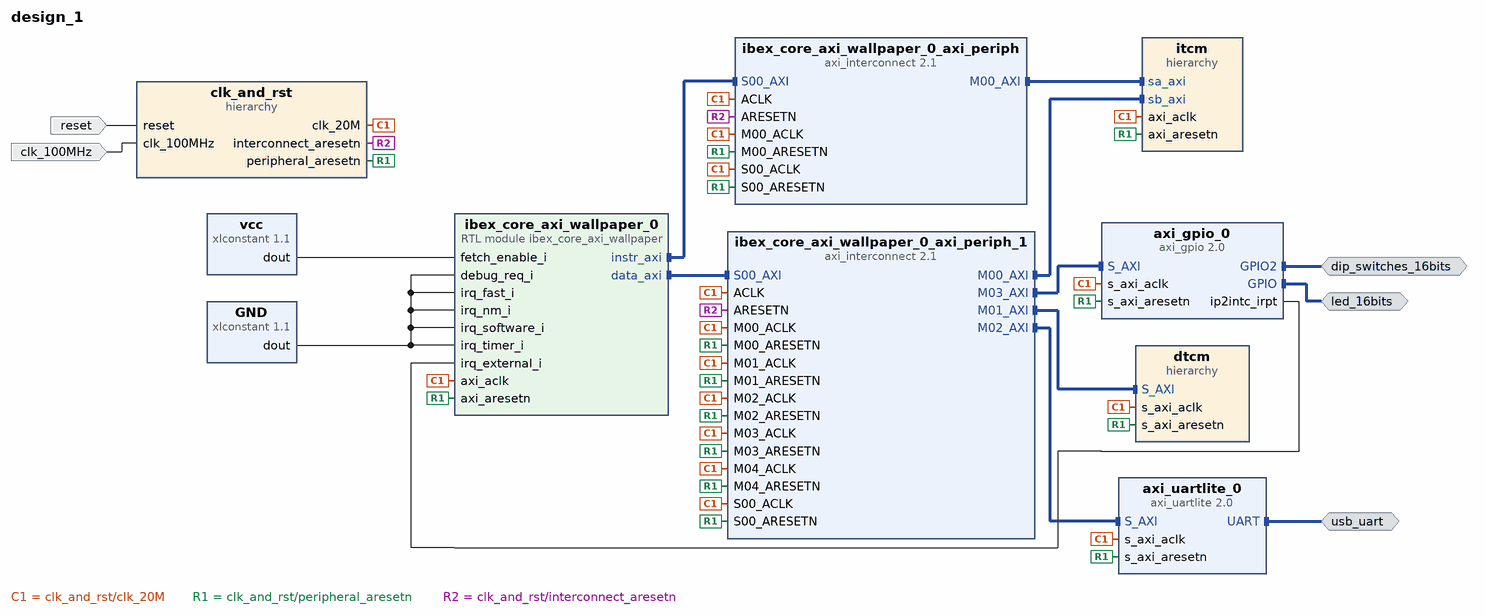
[diagram p0: block diagram of the top level]
# Vivado block design design_1, xc7a100tcsg324-1, Vivado 2017.4
create_bd_design design_1

create_bd_intf_port -mode Master -vlnv xilinx.com:interface:uart_rtl:1.0 usb_uart
create_bd_intf_port -mode Master -vlnv xilinx.com:interface:gpio_rtl:1.0 led_16bits
create_bd_intf_port -mode Master -vlnv xilinx.com:interface:gpio_rtl:1.0 dip_switches_16bits
create_bd_port -dir I -type rst reset
set_property -dict {CONFIG.POLARITY ACTIVE_LOW} [get_bd_ports reset]
create_bd_port -dir I -type clk clk_100MHz
set_property -dict {CONFIG.FREQ_HZ 100000000} [get_bd_ports clk_100MHz]

create_bd_cell -type ip -vlnv xilinx.com:ip:xlconstant:1.1 vcc
create_bd_cell -type ip -vlnv xilinx.com:ip:xlconstant:1.1 GND
set_property -dict {CONFIG.CONST_WIDTH 15 CONFIG.CONST_VAL 0} [get_bd_cells GND]
create_bd_cell -type ip -vlnv xilinx.com:ip:axi_uartlite:2.0 axi_uartlite_0
set_property -dict [list \
  CONFIG.C_BAUDRATE 115200 \
  CONFIG.USE_BOARD_FLOW true \
  CONFIG.UARTLITE_BOARD_INTERFACE usb_uart \
] [get_bd_cells axi_uartlite_0]
create_bd_cell -type ip -vlnv xilinx.com:ip:axi_gpio:2.0 axi_gpio_0
set_property -dict [list \
  CONFIG.C_INTERRUPT_PRESENT 1 \
  CONFIG.USE_BOARD_FLOW true \
  CONFIG.GPIO_BOARD_INTERFACE led_16bits \
  CONFIG.GPIO2_BOARD_INTERFACE dip_switches_16bits \
] [get_bd_cells axi_gpio_0]
create_bd_cell -type hier itcm
create_bd_cell -type hier dtcm
create_bd_cell -type module -reference ibex_core_axi_wallpaper ibex_core_axi_wallpaper_0
create_bd_cell -type ip -vlnv xilinx.com:ip:axi_interconnect:2.1 ibex_core_axi_wallpaper_0_axi_periph
set_property -dict {CONFIG.NUM_MI 1} [get_bd_cells ibex_core_axi_wallpaper_0_axi_periph]
create_bd_cell -type ip -vlnv xilinx.com:ip:axi_interconnect:2.1 ibex_core_axi_wallpaper_0_axi_periph_1
set_property -dict {CONFIG.NUM_MI 5} [get_bd_cells ibex_core_axi_wallpaper_0_axi_periph_1]
create_bd_cell -type hier clk_and_rst

# ---- hierarchy /itcm ----
current_bd_instance /itcm
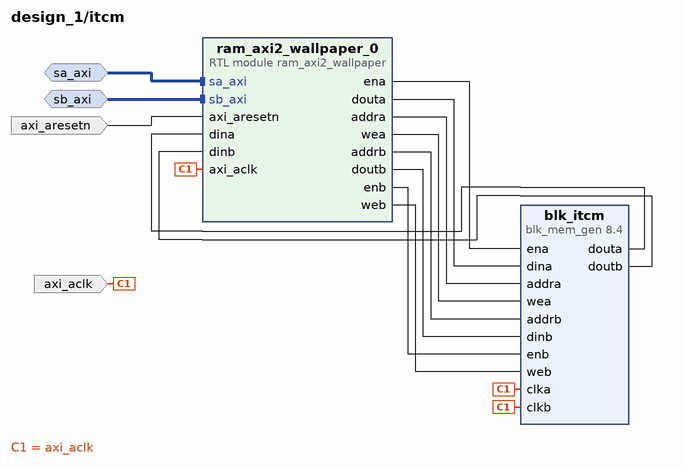
[diagram p1: block diagram inside /itcm]
create_bd_intf_pin -mode Slave -vlnv xilinx.com:interface:aximm_rtl:1.0 sa_axi
create_bd_intf_pin -mode Slave -vlnv xilinx.com:interface:aximm_rtl:1.0 sb_axi
create_bd_pin -dir I -type clk axi_aclk
create_bd_pin -dir I -type rst axi_aresetn

create_bd_cell -type module -reference ram_axi2_wallpaper ram_axi2_wallpaper_0
create_bd_cell -type ip -vlnv xilinx.com:ip:blk_mem_gen:8.4 blk_itcm
set_property -dict [list \
  CONFIG.Memory_Type True_Dual_Port_RAM \
  CONFIG.Enable_32bit_Address true \
  CONFIG.Assume_Synchronous_Clk true \
  CONFIG.Write_Depth_A 16384 \
  CONFIG.Enable_B Use_ENB_Pin \
  CONFIG.Register_PortA_Output_of_Memory_Primitives false \
  CONFIG.Register_PortB_Output_of_Memory_Primitives false \
  CONFIG.Load_Init_File true \
  CONFIG.Coe_File ../../../../../../../rtl/instr_rom_init/instr_rom_init.coe \
  CONFIG.Fill_Remaining_Memory_Locations true \
  CONFIG.Use_RSTA_Pin false \
  CONFIG.Use_RSTB_Pin false \
  CONFIG.Port_B_Clock 100 \
  CONFIG.Port_B_Write_Rate 50 \
  CONFIG.Port_B_Enable_Rate 100 \
  CONFIG.use_bram_block Stand_Alone \
] [get_bd_cells blk_itcm]

# ---- hierarchy /dtcm ----
current_bd_instance /dtcm
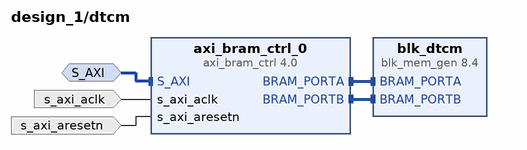
[diagram p2: block diagram inside /dtcm]
create_bd_intf_pin -mode Slave -vlnv xilinx.com:interface:aximm_rtl:1.0 S_AXI
create_bd_pin -dir I -type clk s_axi_aclk
create_bd_pin -dir I -type rst s_axi_aresetn

create_bd_cell -type ip -vlnv xilinx.com:ip:axi_bram_ctrl:4.0 axi_bram_ctrl_0
set_property -dict {CONFIG.SINGLE_PORT_BRAM 0} [get_bd_cells axi_bram_ctrl_0]
create_bd_cell -type ip -vlnv xilinx.com:ip:blk_mem_gen:8.4 blk_dtcm
set_property -dict {CONFIG.Memory_Type True_Dual_Port_RAM} [get_bd_cells blk_dtcm]

# ---- hierarchy /clk_and_rst ----
current_bd_instance /clk_and_rst
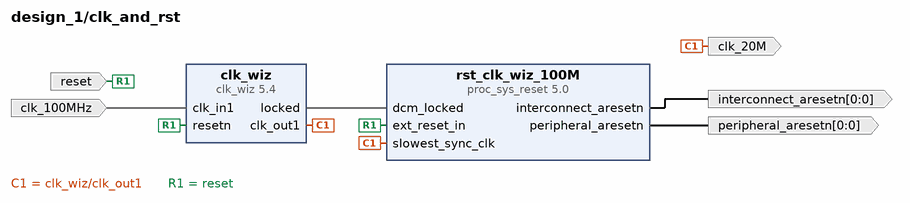
[diagram p3: block diagram inside /clk_and_rst]
create_bd_pin -dir O -type clk clk_20M
create_bd_pin -dir I -type rst reset
create_bd_pin -dir I -type clk clk_100MHz
create_bd_pin -dir O -from 0 -to 0 -type rst interconnect_aresetn
create_bd_pin -dir O -from 0 -to 0 -type rst peripheral_aresetn

create_bd_cell -type ip -vlnv xilinx.com:ip:clk_wiz:5.4 clk_wiz
set_property -dict [list \
  CONFIG.CLKOUT1_REQUESTED_OUT_FREQ 20.000 \
  CONFIG.RESET_PORT resetn \
  CONFIG.MMCM_DIVCLK_DIVIDE 1 \
  CONFIG.MMCM_CLKFBOUT_MULT_F 8.500 \
  CONFIG.MMCM_CLKOUT0_DIVIDE_F 42.500 \
  CONFIG.RESET_TYPE ACTIVE_LOW \
  CONFIG.USE_BOARD_FLOW true \
  CONFIG.CLK_IN1_BOARD_INTERFACE sys_clock \
  CONFIG.RESET_BOARD_INTERFACE reset \
  CONFIG.CLKOUT1_JITTER 193.154 \
  CONFIG.CLKOUT1_PHASE_ERROR 109.126 \
] [get_bd_cells clk_wiz]
create_bd_cell -type ip -vlnv xilinx.com:ip:proc_sys_reset:5.0 rst_clk_wiz_100M
set_property -dict {CONFIG.USE_BOARD_FLOW true CONFIG.RESET_BOARD_INTERFACE reset} [get_bd_cells rst_clk_wiz_100M]

# ---- connections ----

current_bd_instance /itcm
connect_bd_intf_net [get_bd_intf_pins sa_axi] [get_bd_intf_pins ram_axi2_wallpaper_0/sa_axi]
connect_bd_intf_net [get_bd_intf_pins sb_axi] [get_bd_intf_pins ram_axi2_wallpaper_0/sb_axi]
connect_bd_net [get_bd_pins ram_axi2_wallpaper_0/ena] [get_bd_pins blk_itcm/ena]
connect_bd_net [get_bd_pins ram_axi2_wallpaper_0/douta] [get_bd_pins blk_itcm/dina]
connect_bd_net [get_bd_pins ram_axi2_wallpaper_0/addra] [get_bd_pins blk_itcm/addra]
connect_bd_net [get_bd_pins blk_itcm/douta] [get_bd_pins ram_axi2_wallpaper_0/dina]
connect_bd_net [get_bd_pins ram_axi2_wallpaper_0/wea] [get_bd_pins blk_itcm/wea]
connect_bd_net [get_bd_pins ram_axi2_wallpaper_0/addrb] [get_bd_pins blk_itcm/addrb]
connect_bd_net [get_bd_pins ram_axi2_wallpaper_0/doutb] [get_bd_pins blk_itcm/dinb]
connect_bd_net [get_bd_pins ram_axi2_wallpaper_0/enb] [get_bd_pins blk_itcm/enb]
connect_bd_net [get_bd_pins ram_axi2_wallpaper_0/web] [get_bd_pins blk_itcm/web]
connect_bd_net [get_bd_pins blk_itcm/doutb] [get_bd_pins ram_axi2_wallpaper_0/dinb]
connect_bd_net [get_bd_pins axi_aclk] [get_bd_pins ram_axi2_wallpaper_0/axi_aclk] [get_bd_pins blk_itcm/clka] [get_bd_pins blk_itcm/clkb]
connect_bd_net [get_bd_pins axi_aresetn] [get_bd_pins ram_axi2_wallpaper_0/axi_aresetn]

current_bd_instance /dtcm
connect_bd_intf_net [get_bd_intf_pins blk_dtcm/BRAM_PORTA] [get_bd_intf_pins axi_bram_ctrl_0/BRAM_PORTA]
connect_bd_intf_net [get_bd_intf_pins blk_dtcm/BRAM_PORTB] [get_bd_intf_pins axi_bram_ctrl_0/BRAM_PORTB]
connect_bd_intf_net [get_bd_intf_pins S_AXI] [get_bd_intf_pins axi_bram_ctrl_0/S_AXI]
connect_bd_net [get_bd_pins s_axi_aclk] [get_bd_pins axi_bram_ctrl_0/s_axi_aclk]
connect_bd_net [get_bd_pins s_axi_aresetn] [get_bd_pins axi_bram_ctrl_0/s_axi_aresetn]

current_bd_instance /clk_and_rst
connect_bd_net [get_bd_pins clk_wiz/clk_out1] [get_bd_pins clk_20M] [get_bd_pins rst_clk_wiz_100M/slowest_sync_clk]
connect_bd_net [get_bd_pins reset] [get_bd_pins clk_wiz/resetn] [get_bd_pins rst_clk_wiz_100M/ext_reset_in]
connect_bd_net [get_bd_pins clk_100MHz] [get_bd_pins clk_wiz/clk_in1]
connect_bd_net [get_bd_pins clk_wiz/locked] [get_bd_pins rst_clk_wiz_100M/dcm_locked]
connect_bd_net [get_bd_pins rst_clk_wiz_100M/interconnect_aresetn] [get_bd_pins interconnect_aresetn]
connect_bd_net [get_bd_pins rst_clk_wiz_100M/peripheral_aresetn] [get_bd_pins peripheral_aresetn]

current_bd_instance /
connect_bd_intf_net [get_bd_intf_pins ibex_core_axi_wallpaper_0/instr_axi] [get_bd_intf_pins ibex_core_axi_wallpaper_0_axi_periph/S00_AXI]
connect_bd_intf_net [get_bd_intf_pins ibex_core_axi_wallpaper_0_axi_periph/M00_AXI] [get_bd_intf_pins itcm/sa_axi]
connect_bd_intf_net [get_bd_intf_pins ibex_core_axi_wallpaper_0/data_axi] [get_bd_intf_pins ibex_core_axi_wallpaper_0_axi_periph_1/S00_AXI]
connect_bd_intf_net [get_bd_intf_pins ibex_core_axi_wallpaper_0_axi_periph_1/M00_AXI] [get_bd_intf_pins itcm/sb_axi]
connect_bd_intf_net [get_bd_intf_pins ibex_core_axi_wallpaper_0_axi_periph_1/M01_AXI] [get_bd_intf_pins dtcm/S_AXI]
connect_bd_intf_net [get_bd_intf_pins ibex_core_axi_wallpaper_0_axi_periph_1/M02_AXI] [get_bd_intf_pins axi_uartlite_0/S_AXI]
connect_bd_intf_net [get_bd_intf_pins ibex_core_axi_wallpaper_0_axi_periph_1/M03_AXI] [get_bd_intf_pins axi_gpio_0/S_AXI]
connect_bd_intf_net [get_bd_intf_ports usb_uart] [get_bd_intf_pins axi_uartlite_0/UART]
connect_bd_intf_net [get_bd_intf_ports led_16bits] [get_bd_intf_pins axi_gpio_0/GPIO]
connect_bd_intf_net [get_bd_intf_ports dip_switches_16bits] [get_bd_intf_pins axi_gpio_0/GPIO2]
connect_bd_net -net clk_wiz_clk_out1 [get_bd_pins clk_and_rst/clk_20M] \
  [get_bd_pins ibex_core_axi_wallpaper_0/axi_aclk] [get_bd_pins axi_uartlite_0/s_axi_aclk] \
  [get_bd_pins axi_gpio_0/s_axi_aclk] [get_bd_pins ibex_core_axi_wallpaper_0_axi_periph/S00_ACLK] [get_bd_pins itcm/axi_aclk] \
  [get_bd_pins ibex_core_axi_wallpaper_0_axi_periph/M00_ACLK] [get_bd_pins ibex_core_axi_wallpaper_0_axi_periph/ACLK] \
  [get_bd_pins ibex_core_axi_wallpaper_0_axi_periph_1/S00_ACLK] [get_bd_pins ibex_core_axi_wallpaper_0_axi_periph_1/M00_ACLK] \
  [get_bd_pins ibex_core_axi_wallpaper_0_axi_periph_1/ACLK] [get_bd_pins dtcm/s_axi_aclk] \
  [get_bd_pins ibex_core_axi_wallpaper_0_axi_periph_1/M01_ACLK] [get_bd_pins ibex_core_axi_wallpaper_0_axi_periph_1/M02_ACLK] \
  [get_bd_pins ibex_core_axi_wallpaper_0_axi_periph_1/M03_ACLK] [get_bd_pins ibex_core_axi_wallpaper_0_axi_periph_1/M04_ACLK]
connect_bd_net -net rst_clk_wiz_100M_peripheral_aresetn [get_bd_pins clk_and_rst/peripheral_aresetn] \
  [get_bd_pins ibex_core_axi_wallpaper_0/axi_aresetn] [get_bd_pins axi_uartlite_0/s_axi_aresetn] \
  [get_bd_pins axi_gpio_0/s_axi_aresetn] [get_bd_pins ibex_core_axi_wallpaper_0_axi_periph/S00_ARESETN] \
  [get_bd_pins itcm/axi_aresetn] [get_bd_pins ibex_core_axi_wallpaper_0_axi_periph/M00_ARESETN] \
  [get_bd_pins ibex_core_axi_wallpaper_0_axi_periph_1/S00_ARESETN] \
  [get_bd_pins ibex_core_axi_wallpaper_0_axi_periph_1/M00_ARESETN] [get_bd_pins dtcm/s_axi_aresetn] \
  [get_bd_pins ibex_core_axi_wallpaper_0_axi_periph_1/M01_ARESETN] \
  [get_bd_pins ibex_core_axi_wallpaper_0_axi_periph_1/M02_ARESETN] \
  [get_bd_pins ibex_core_axi_wallpaper_0_axi_periph_1/M03_ARESETN] \
  [get_bd_pins ibex_core_axi_wallpaper_0_axi_periph_1/M04_ARESETN]
connect_bd_net [get_bd_pins vcc/dout] [get_bd_pins ibex_core_axi_wallpaper_0/fetch_enable_i]
connect_bd_net -net xlconstant_0_dout [get_bd_pins GND/dout] \
  [get_bd_pins ibex_core_axi_wallpaper_0/irq_software_i] [get_bd_pins ibex_core_axi_wallpaper_0/irq_timer_i] \
  [get_bd_pins ibex_core_axi_wallpaper_0/irq_fast_i] [get_bd_pins ibex_core_axi_wallpaper_0/irq_nm_i] \
  [get_bd_pins ibex_core_axi_wallpaper_0/debug_req_i]
connect_bd_net -net rst_clk_wiz_100M_interconnect_aresetn [get_bd_pins clk_and_rst/interconnect_aresetn] \
  [get_bd_pins ibex_core_axi_wallpaper_0_axi_periph/ARESETN] [get_bd_pins ibex_core_axi_wallpaper_0_axi_periph_1/ARESETN]
connect_bd_net [get_bd_ports reset] [get_bd_pins clk_and_rst/reset]
connect_bd_net [get_bd_ports clk_100MHz] [get_bd_pins clk_and_rst/clk_100MHz]
connect_bd_net [get_bd_pins axi_gpio_0/ip2intc_irpt] [get_bd_pins ibex_core_axi_wallpaper_0/irq_external_i]

# ---- address map ----
assign_bd_address -offset 0x10012000 -range 4K -target_address_space [get_bd_addr_spaces ibex_core_axi_wallpaper_0/data_axi] [get_bd_addr_segs axi_gpio_0/S_AXI/Reg]
assign_bd_address -offset 0x10013000 -range 4K -target_address_space [get_bd_addr_spaces ibex_core_axi_wallpaper_0/data_axi] [get_bd_addr_segs axi_uartlite_0/S_AXI/Reg]
assign_bd_address -offset 0x80000000 -range 64K -target_address_space [get_bd_addr_spaces ibex_core_axi_wallpaper_0/data_axi] [get_bd_addr_segs itcm/ram_axi2_wallpaper_0/sb_axi/reg0]
assign_bd_address -offset 0x90000000 -range 64K -target_address_space [get_bd_addr_spaces ibex_core_axi_wallpaper_0/data_axi] [get_bd_addr_segs dtcm/axi_bram_ctrl_0/S_AXI/Mem0]
assign_bd_address -offset 0x80000000 -range 64K -target_address_space [get_bd_addr_spaces ibex_core_axi_wallpaper_0/instr_axi] [get_bd_addr_segs itcm/ram_axi2_wallpaper_0/sa_axi/reg0]

validate_bd_design
save_bd_design
